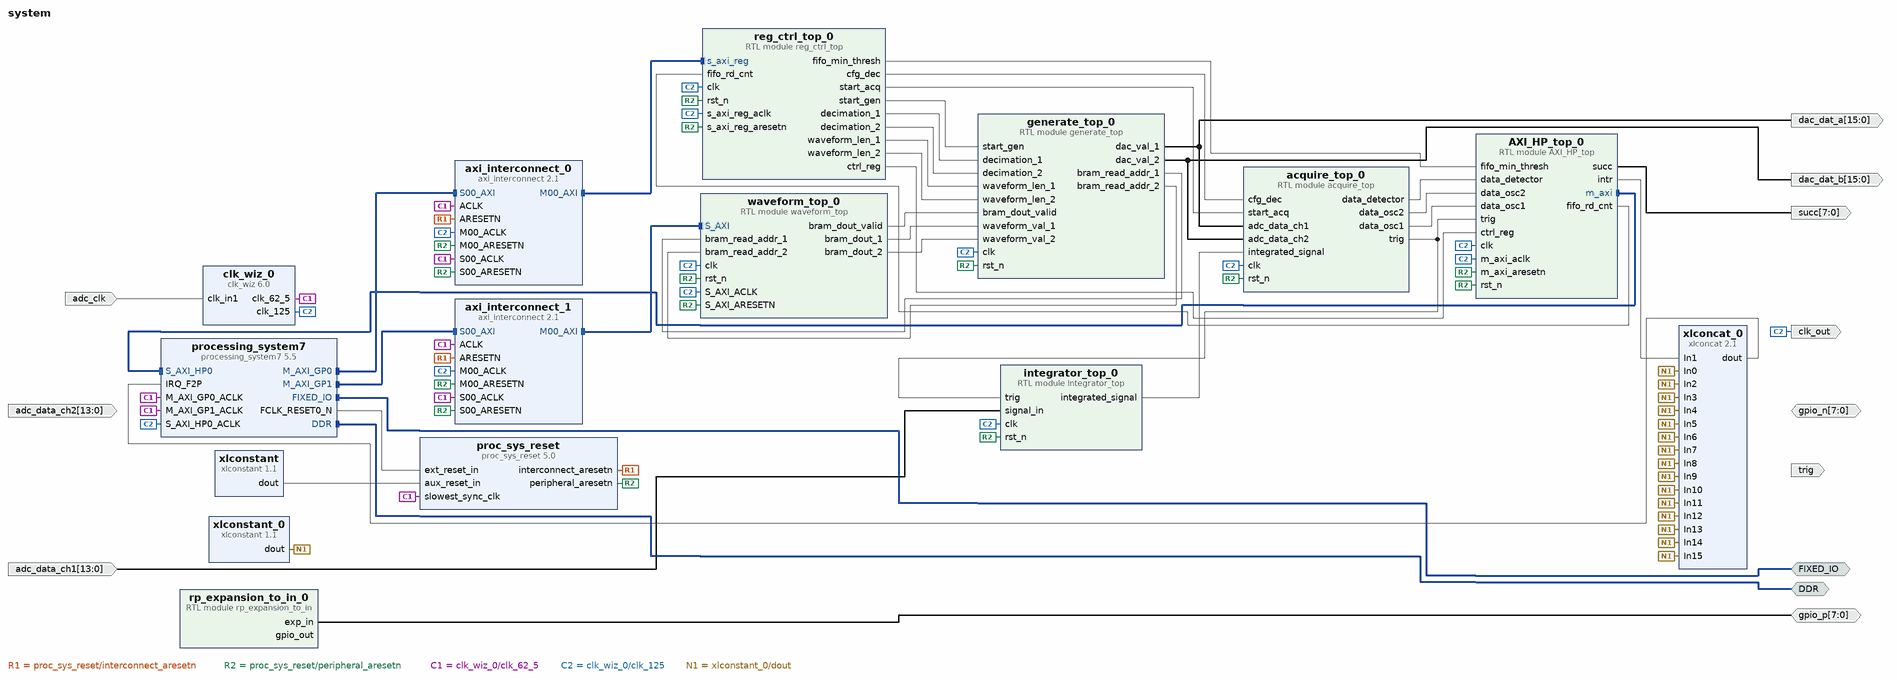
[diagram p0: block diagram of the top level]
# Vivado block design system, xc7z010clg400-1, Vivado 2020.1
create_bd_design system

create_bd_intf_port -mode Master -vlnv xilinx.com:interface:ddrx_rtl:1.0 DDR
create_bd_intf_port -mode Master -vlnv xilinx.com:display_processing_system7:fixedio_rtl:1.0 FIXED_IO
create_bd_port -dir I -from 13 -to 0 adc_data_ch1
create_bd_port -dir I -from 13 -to 0 adc_data_ch2
create_bd_port -dir IO -from 7 -to 0 gpio_n
create_bd_port -dir I -type clk adc_clk
set_property -dict {CONFIG.FREQ_HZ 125000000} [get_bd_ports adc_clk]
create_bd_port -dir O -from 15 -to 0 dac_dat_a
create_bd_port -dir O -from 15 -to 0 dac_dat_b
create_bd_port -dir O -type clk clk_out
set_property -dict {CONFIG.FREQ_HZ 125000000} [get_bd_ports clk_out]
create_bd_port -dir O -type data trig
create_bd_port -dir O -from 7 -to 0 -type data succ
create_bd_port -dir IO -from 7 -to 0 gpio_p

create_bd_cell -type ip -vlnv xilinx.com:ip:proc_sys_reset:5.0 proc_sys_reset
set_property -dict {CONFIG.C_EXT_RST_WIDTH 1} [get_bd_cells proc_sys_reset]
create_bd_cell -type ip -vlnv xilinx.com:ip:processing_system7:5.5 processing_system7
set_property -dict [list \
  CONFIG.PCW_ENET0_ENET0_IO {MIO 16 .. 27} \
  CONFIG.PCW_ENET0_GRP_MDIO_ENABLE 1 \
  CONFIG.PCW_ENET0_GRP_MDIO_IO {MIO 52 .. 53} \
  CONFIG.PCW_ENET0_PERIPHERAL_ENABLE 1 \
  CONFIG.PCW_ENET0_RESET_ENABLE 0 \
  CONFIG.PCW_ENET_RESET_ENABLE 1 \
  CONFIG.PCW_ENET_RESET_SELECT {Share reset pin} \
  CONFIG.PCW_EN_CLK0_PORT 0 \
  CONFIG.PCW_FPGA0_PERIPHERAL_FREQMHZ 125 \
  CONFIG.PCW_FPGA1_PERIPHERAL_FREQMHZ 250 \
  CONFIG.PCW_FPGA2_PERIPHERAL_FREQMHZ 62.5 \
  CONFIG.PCW_FPGA3_PERIPHERAL_FREQMHZ 200 \
  CONFIG.PCW_GPIO_EMIO_GPIO_ENABLE 1 \
  CONFIG.PCW_GPIO_EMIO_GPIO_IO 24 \
  CONFIG.PCW_GPIO_EMIO_GPIO_WIDTH 24 \
  CONFIG.PCW_GPIO_MIO_GPIO_ENABLE 1 \
  CONFIG.PCW_GPIO_MIO_GPIO_IO MIO \
  CONFIG.PCW_I2C0_GRP_INT_ENABLE 0 \
  CONFIG.PCW_I2C0_I2C0_IO {MIO 50 .. 51} \
  CONFIG.PCW_I2C0_PERIPHERAL_ENABLE 1 \
  CONFIG.PCW_I2C_PERIPHERAL_FREQMHZ 111.111115 \
  CONFIG.PCW_I2C_RESET_ENABLE 1 \
  CONFIG.PCW_I2C_RESET_SELECT {Share reset pin} \
  CONFIG.PCW_IRQ_F2P_INTR 1 \
  CONFIG.PCW_PRESET_BANK1_VOLTAGE {LVCMOS 2.5V} \
  CONFIG.PCW_QSPI_GRP_SINGLE_SS_ENABLE 1 \
  CONFIG.PCW_QSPI_GRP_SINGLE_SS_IO {MIO 1 .. 6} \
  CONFIG.PCW_QSPI_PERIPHERAL_ENABLE 1 \
  CONFIG.PCW_QSPI_PERIPHERAL_FREQMHZ 125 \
  CONFIG.PCW_QSPI_QSPI_IO {MIO 1 .. 6} \
  CONFIG.PCW_SD0_GRP_CD_ENABLE 1 \
  CONFIG.PCW_SD0_GRP_CD_IO {MIO 46} \
  CONFIG.PCW_SD0_GRP_WP_ENABLE 1 \
  CONFIG.PCW_SD0_GRP_WP_IO {MIO 47} \
  CONFIG.PCW_SD0_PERIPHERAL_ENABLE 1 \
  CONFIG.PCW_SD0_SD0_IO {MIO 40 .. 45} \
  CONFIG.PCW_SDIO_PERIPHERAL_FREQMHZ 100 \
  CONFIG.PCW_SINGLE_QSPI_DATA_MODE x4 \
  CONFIG.PCW_SPI0_PERIPHERAL_ENABLE 1 \
  CONFIG.PCW_SPI0_SPI0_IO EMIO \
  CONFIG.PCW_SPI1_PERIPHERAL_ENABLE 1 \
  CONFIG.PCW_SPI1_SPI1_IO {MIO 10 .. 15} \
  CONFIG.PCW_SPI_PERIPHERAL_FREQMHZ 200 \
  CONFIG.PCW_TTC0_PERIPHERAL_ENABLE 1 \
  CONFIG.PCW_TTC0_TTC0_IO EMIO \
  CONFIG.PCW_UART0_PERIPHERAL_ENABLE 1 \
  CONFIG.PCW_UART0_UART0_IO {MIO 14 .. 15} \
  CONFIG.PCW_UART1_PERIPHERAL_ENABLE 1 \
  CONFIG.PCW_UART1_UART1_IO {MIO 8 .. 9} \
  CONFIG.PCW_UART_PERIPHERAL_FREQMHZ 100 \
  CONFIG.PCW_UIPARAM_DDR_BUS_WIDTH {16 Bit} \
  CONFIG.PCW_UIPARAM_DDR_PARTNO {MT41J256M16 RE-125} \
  CONFIG.PCW_USB0_PERIPHERAL_ENABLE 1 \
  CONFIG.PCW_USB0_RESET_ENABLE 1 \
  CONFIG.PCW_USB0_RESET_IO {MIO 48} \
  CONFIG.PCW_USB0_USB0_IO {MIO 28 .. 39} \
  CONFIG.PCW_USB_RESET_ENABLE 1 \
  CONFIG.PCW_USB_RESET_SELECT {Share reset pin} \
  CONFIG.PCW_USE_FABRIC_INTERRUPT 1 \
  CONFIG.PCW_USE_M_AXI_GP1 1 \
  CONFIG.PCW_USE_S_AXI_HP0 1 \
] [get_bd_cells processing_system7]
# 228 more settings of processing_system7 are not shown: defaults, MIO pin electricals, DDR timing, and values the tool derives
create_bd_cell -type ip -vlnv xilinx.com:ip:xlconstant:1.1 xlconstant
create_bd_cell -type ip -vlnv xilinx.com:ip:axi_interconnect:2.1 axi_interconnect_0
set_property -dict {CONFIG.NUM_MI 1} [get_bd_cells axi_interconnect_0]
create_bd_cell -type ip -vlnv xilinx.com:ip:clk_wiz:6.0 clk_wiz_0
set_property -dict [list \
  CONFIG.CLKIN1_JITTER_PS 80.0 \
  CONFIG.CLKOUT1_JITTER 119.348 \
  CONFIG.CLKOUT1_PHASE_ERROR 96.948 \
  CONFIG.CLKOUT1_REQUESTED_OUT_FREQ 125.000 \
  CONFIG.CLKOUT2_JITTER 137.150 \
  CONFIG.CLKOUT2_PHASE_ERROR 96.948 \
  CONFIG.CLKOUT2_REQUESTED_OUT_FREQ 62.5 \
  CONFIG.CLKOUT2_USED true \
  CONFIG.CLK_OUT1_PORT clk_125 \
  CONFIG.CLK_OUT2_PORT clk_62_5 \
  CONFIG.MMCM_CLKFBOUT_MULT_F 8.000 \
  CONFIG.MMCM_CLKIN1_PERIOD 8.000 \
  CONFIG.MMCM_CLKOUT0_DIVIDE_F 8.000 \
  CONFIG.MMCM_CLKOUT1_DIVIDE 16 \
  CONFIG.NUM_OUT_CLKS 2 \
  CONFIG.PRIM_IN_FREQ 125 \
] [get_bd_cells clk_wiz_0]
create_bd_cell -type ip -vlnv xilinx.com:ip:xlconcat:2.1 xlconcat_0
set_property -dict {CONFIG.NUM_PORTS 16} [get_bd_cells xlconcat_0]
create_bd_cell -type ip -vlnv xilinx.com:ip:xlconstant:1.1 xlconstant_0
set_property -dict {CONFIG.CONST_VAL 0} [get_bd_cells xlconstant_0]
create_bd_cell -type ip -vlnv xilinx.com:ip:axi_interconnect:2.1 axi_interconnect_1
set_property -dict {CONFIG.NUM_MI 1} [get_bd_cells axi_interconnect_1]
create_bd_cell -type module -reference integrator_top integrator_top_0
create_bd_cell -type module -reference rp_expansion_to_in rp_expansion_to_in_0
create_bd_cell -type module -reference reg_ctrl_top reg_ctrl_top_0
create_bd_cell -type module -reference generate_top generate_top_0
create_bd_cell -type module -reference acquire_top acquire_top_0
create_bd_cell -type module -reference waveform_top waveform_top_0
create_bd_cell -type module -reference AXI_HP_top AXI_HP_top_0

# ---- connections ----

connect_bd_intf_net [get_bd_intf_pins processing_system7/M_AXI_GP1] [get_bd_intf_pins axi_interconnect_1/S00_AXI]
connect_bd_intf_net [get_bd_intf_pins processing_system7/M_AXI_GP0] [get_bd_intf_pins axi_interconnect_0/S00_AXI]
connect_bd_intf_net [get_bd_intf_pins axi_interconnect_0/M00_AXI] [get_bd_intf_pins reg_ctrl_top_0/s_axi_reg]
connect_bd_intf_net [get_bd_intf_ports FIXED_IO] [get_bd_intf_pins processing_system7/FIXED_IO]
connect_bd_intf_net [get_bd_intf_ports DDR] [get_bd_intf_pins processing_system7/DDR]
connect_bd_intf_net [get_bd_intf_pins waveform_top_0/S_AXI] [get_bd_intf_pins axi_interconnect_1/M00_AXI]
connect_bd_intf_net [get_bd_intf_pins AXI_HP_top_0/m_axi] [get_bd_intf_pins processing_system7/S_AXI_HP0]
connect_bd_net [get_bd_pins xlconstant/dout] [get_bd_pins proc_sys_reset/aux_reset_in]
connect_bd_net [get_bd_pins processing_system7/FCLK_RESET0_N] [get_bd_pins proc_sys_reset/ext_reset_in]
connect_bd_net -net acquire_top_0_succ [get_bd_pins AXI_HP_top_0/succ] [get_bd_ports succ]
connect_bd_net [get_bd_pins proc_sys_reset/interconnect_aresetn] [get_bd_pins axi_interconnect_0/ARESETN] [get_bd_pins axi_interconnect_1/ARESETN]
connect_bd_net -net M00_ARESETN_1 [get_bd_pins proc_sys_reset/peripheral_aresetn] \
  [get_bd_pins axi_interconnect_0/M00_ARESETN] [get_bd_pins axi_interconnect_0/S00_ARESETN] \
  [get_bd_pins axi_interconnect_1/S00_ARESETN] [get_bd_pins axi_interconnect_1/M00_ARESETN] \
  [get_bd_pins integrator_top_0/rst_n] [get_bd_pins reg_ctrl_top_0/rst_n] [get_bd_pins reg_ctrl_top_0/s_axi_reg_aresetn] \
  [get_bd_pins generate_top_0/rst_n] [get_bd_pins acquire_top_0/rst_n] [get_bd_pins waveform_top_0/rst_n] \
  [get_bd_pins waveform_top_0/S_AXI_ARESETN] [get_bd_pins AXI_HP_top_0/rst_n] [get_bd_pins AXI_HP_top_0/m_axi_aresetn]
connect_bd_net -net ACLK_1 [get_bd_pins clk_wiz_0/clk_62_5] \
  [get_bd_pins axi_interconnect_0/ACLK] [get_bd_pins axi_interconnect_0/S00_ACLK] \
  [get_bd_pins proc_sys_reset/slowest_sync_clk] [get_bd_pins processing_system7/M_AXI_GP0_ACLK] \
  [get_bd_pins axi_interconnect_1/S00_ACLK] [get_bd_pins axi_interconnect_1/ACLK] \
  [get_bd_pins processing_system7/M_AXI_GP1_ACLK]
connect_bd_net -net clk_gen_locked [get_bd_pins clk_wiz_0/clk_125] \
  [get_bd_pins axi_interconnect_0/M00_ACLK] [get_bd_pins processing_system7/S_AXI_HP0_ACLK] [get_bd_ports clk_out] \
  [get_bd_pins axi_interconnect_1/M00_ACLK] [get_bd_pins integrator_top_0/clk] [get_bd_pins reg_ctrl_top_0/clk] \
  [get_bd_pins reg_ctrl_top_0/s_axi_reg_aclk] [get_bd_pins generate_top_0/clk] [get_bd_pins acquire_top_0/clk] \
  [get_bd_pins waveform_top_0/clk] [get_bd_pins waveform_top_0/S_AXI_ACLK] [get_bd_pins AXI_HP_top_0/clk] \
  [get_bd_pins AXI_HP_top_0/m_axi_aclk]
connect_bd_net [get_bd_ports adc_clk] [get_bd_pins clk_wiz_0/clk_in1]
connect_bd_net [get_bd_pins xlconcat_0/dout] [get_bd_pins processing_system7/IRQ_F2P]
connect_bd_net [get_bd_pins xlconstant_0/dout] \
  [get_bd_pins xlconcat_0/In2] [get_bd_pins xlconcat_0/In3] [get_bd_pins xlconcat_0/In4] [get_bd_pins xlconcat_0/In5] \
  [get_bd_pins xlconcat_0/In6] [get_bd_pins xlconcat_0/In7] [get_bd_pins xlconcat_0/In8] [get_bd_pins xlconcat_0/In9] \
  [get_bd_pins xlconcat_0/In10] [get_bd_pins xlconcat_0/In11] [get_bd_pins xlconcat_0/In12] [get_bd_pins xlconcat_0/In13] \
  [get_bd_pins xlconcat_0/In14] [get_bd_pins xlconcat_0/In15] [get_bd_pins xlconcat_0/In0]
connect_bd_net [get_bd_pins reg_ctrl_top_0/fifo_min_thresh] [get_bd_pins AXI_HP_top_0/fifo_min_thresh]
connect_bd_net [get_bd_pins reg_ctrl_top_0/ctrl_reg] [get_bd_pins AXI_HP_top_0/ctrl_reg]
connect_bd_net [get_bd_pins reg_ctrl_top_0/cfg_dec] [get_bd_pins acquire_top_0/cfg_dec]
connect_bd_net [get_bd_pins reg_ctrl_top_0/start_acq] [get_bd_pins acquire_top_0/start_acq]
connect_bd_net [get_bd_pins AXI_HP_top_0/intr] [get_bd_pins xlconcat_0/In1]
connect_bd_net [get_bd_pins AXI_HP_top_0/fifo_rd_cnt] [get_bd_pins reg_ctrl_top_0/fifo_rd_cnt]
connect_bd_net [get_bd_pins waveform_top_0/bram_dout_valid] [get_bd_pins generate_top_0/bram_dout_valid]
connect_bd_net [get_bd_pins waveform_top_0/bram_dout_1] [get_bd_pins generate_top_0/waveform_val_1]
connect_bd_net [get_bd_pins waveform_top_0/bram_dout_2] [get_bd_pins generate_top_0/waveform_val_2]
connect_bd_net [get_bd_pins generate_top_0/bram_read_addr_1] [get_bd_pins waveform_top_0/bram_read_addr_1]
connect_bd_net [get_bd_pins generate_top_0/bram_read_addr_2] [get_bd_pins waveform_top_0/bram_read_addr_2]
connect_bd_net [get_bd_pins generate_top_0/dac_val_1] [get_bd_ports dac_dat_a] [get_bd_pins acquire_top_0/adc_data_ch1]
connect_bd_net [get_bd_pins generate_top_0/dac_val_2] [get_bd_ports dac_dat_b] [get_bd_pins acquire_top_0/adc_data_ch2]
connect_bd_net [get_bd_pins reg_ctrl_top_0/start_gen] [get_bd_pins generate_top_0/start_gen]
connect_bd_net [get_bd_pins reg_ctrl_top_0/decimation_1] [get_bd_pins generate_top_0/decimation_1]
connect_bd_net [get_bd_pins reg_ctrl_top_0/decimation_2] [get_bd_pins generate_top_0/decimation_2]
connect_bd_net [get_bd_pins integrator_top_0/integrated_signal] [get_bd_pins acquire_top_0/integrated_signal]
connect_bd_net [get_bd_pins acquire_top_0/data_detector] [get_bd_pins AXI_HP_top_0/data_detector]
connect_bd_net [get_bd_pins acquire_top_0/data_osc2] [get_bd_pins AXI_HP_top_0/data_osc2]
connect_bd_net [get_bd_pins acquire_top_0/data_osc1] [get_bd_pins AXI_HP_top_0/data_osc1]
connect_bd_net [get_bd_pins acquire_top_0/trig] [get_bd_pins integrator_top_0/trig] [get_bd_pins AXI_HP_top_0/trig]
connect_bd_net -net adc_data_ch1_1 [get_bd_ports adc_data_ch1] [get_bd_pins integrator_top_0/signal_in]
# net rp_expansion_to_in_0_gpio_out has one end: rp_expansion_to_in_0/gpio_out
connect_bd_net [get_bd_ports gpio_p] [get_bd_pins rp_expansion_to_in_0/exp_in]
connect_bd_net [get_bd_pins reg_ctrl_top_0/waveform_len_1] [get_bd_pins generate_top_0/waveform_len_1]
connect_bd_net [get_bd_pins reg_ctrl_top_0/waveform_len_2] [get_bd_pins generate_top_0/waveform_len_2]

# ---- address map ----
assign_bd_address -offset 0x00000000 -range 512M -target_address_space [get_bd_addr_spaces AXI_HP_top_0/m_axi] [get_bd_addr_segs processing_system7/S_AXI_HP0/HP0_DDR_LOWOCM]
assign_bd_address -offset 0x40000000 -range 256M -target_address_space [get_bd_addr_spaces processing_system7/Data] [get_bd_addr_segs reg_ctrl_top_0/s_axi_reg/reg0]
assign_bd_address -offset 0x80000000 -range 256M -target_address_space [get_bd_addr_spaces processing_system7/Data] [get_bd_addr_segs waveform_top_0/S_AXI/reg0]

validate_bd_design
save_bd_design
